# EAGLE design P1AM_Serial_Adapter_Board (EAGLE 9.6.2)
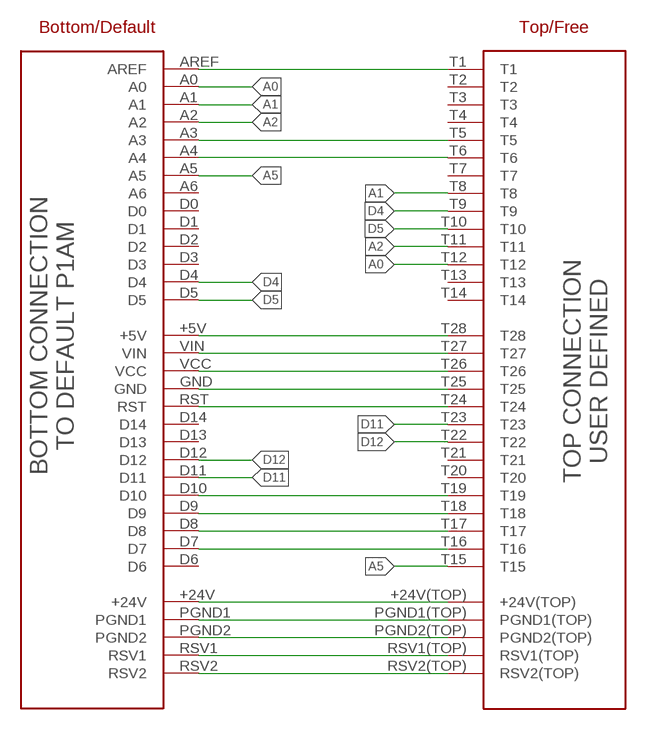
[diagram p0: schematic, sheet 1]

## Parts
J1  P1AM-PROTO-BLANK-SMD_HEADERS  [P1AM-PROTO-BLANK-SMD_HEADERS]

## Nets
5V: J1.+5V J1.T28
24V: J1.+24V J1.+24V(TOP)
A0: J1.A0 J1.T12
A1: J1.A1 J1.T8
A2: J1.A2 J1.T11
A3: J1.A3 J1.T5
A4: J1.A4 J1.T6
A5: J1.A5 J1.T15
AREF: J1.AREF J1.T1
D4: J1.D4 J1.T9
D5: J1.D5 J1.T10
D7: J1.D7 J1.T16
D8: J1.D8 J1.T17
D9: J1.D9 J1.T18
D10: J1.D10 J1.T19
D11: J1.D11 J1.T23
D12: J1.D12 J1.T22
GND: J1.GND J1.T25
PGND1: J1.PGND1 J1.PGND1(TOP)
PGND2: J1.PGND2 J1.PGND2(TOP)
RST: J1.RST J1.T24
RSV1: J1.RSV1 J1.RSV1(TOP)
RSV2: J1.RSV2 J1.RSV2(TOP)
VCC: J1.T26 J1.VCC
VIN: J1.T27 J1.VIN
Unconnected: J1.A6 J1.D0 J1.D1 J1.D2 J1.D3 J1.D6 J1.D13 J1.D14 J1.T2 J1.T3 J1.T4 J1.T7 J1.T13 J1.T14 J1.T20 J1.T21

## Library data of the parts
J1 = P1AM:P1AM-PROTO-BLANK-SMD_HEADERS

## Board
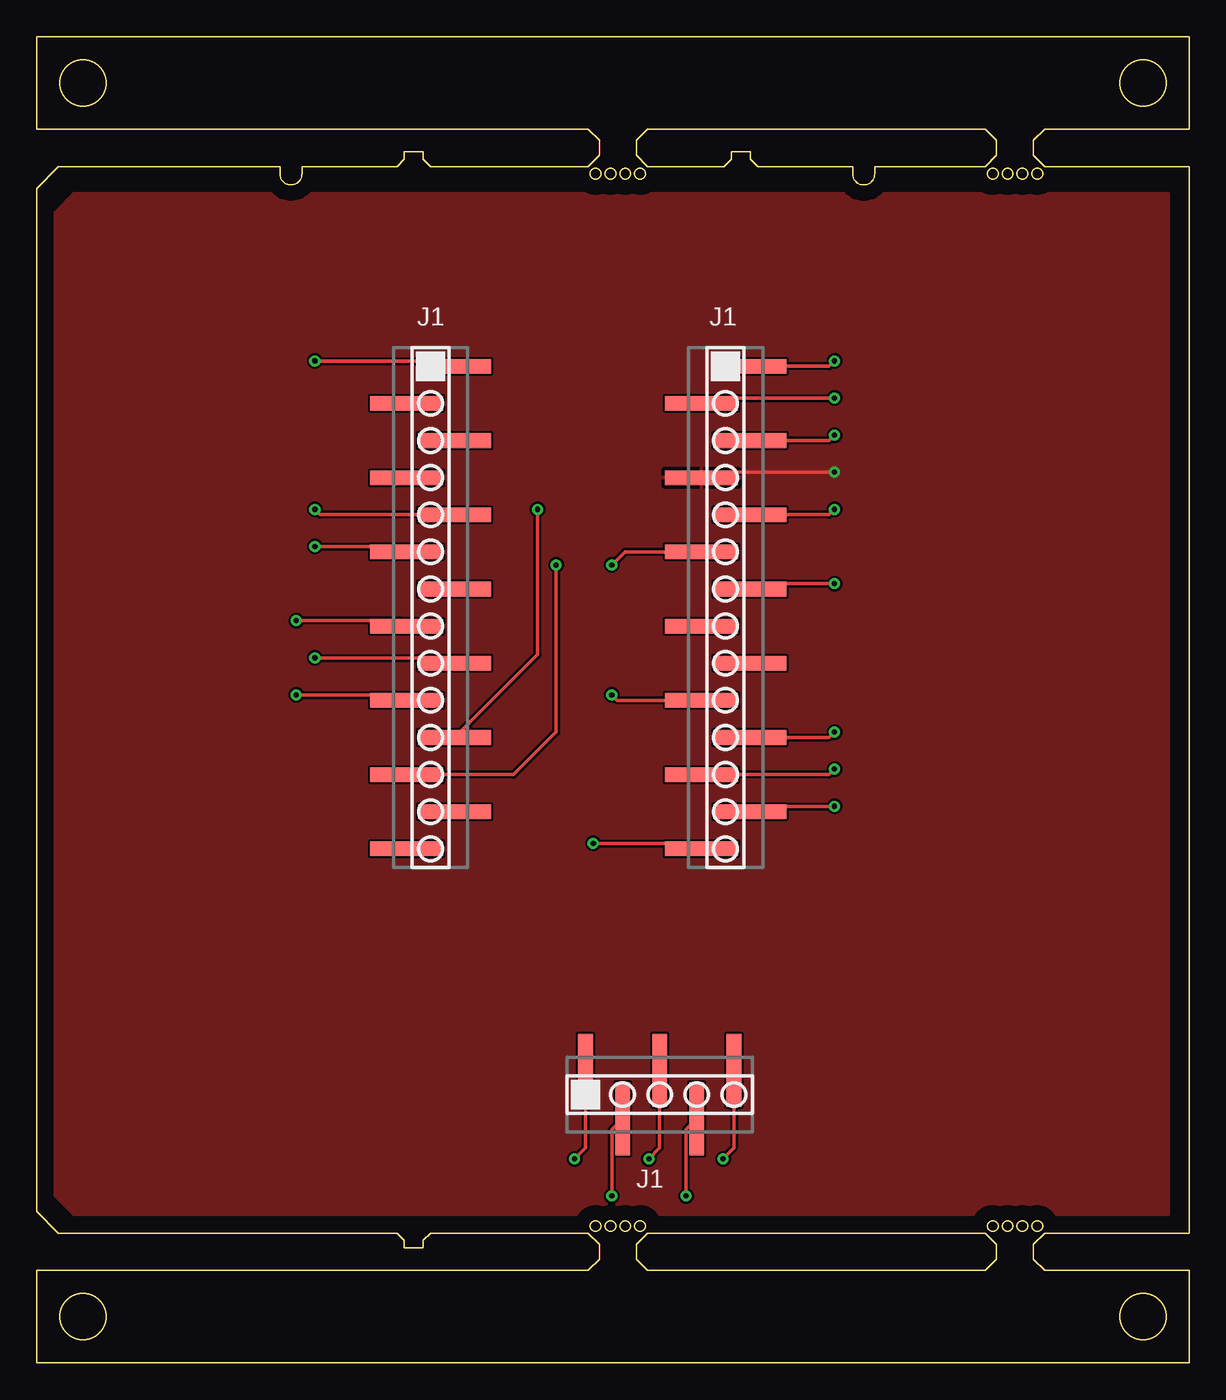
[diagram p1: board, top side]
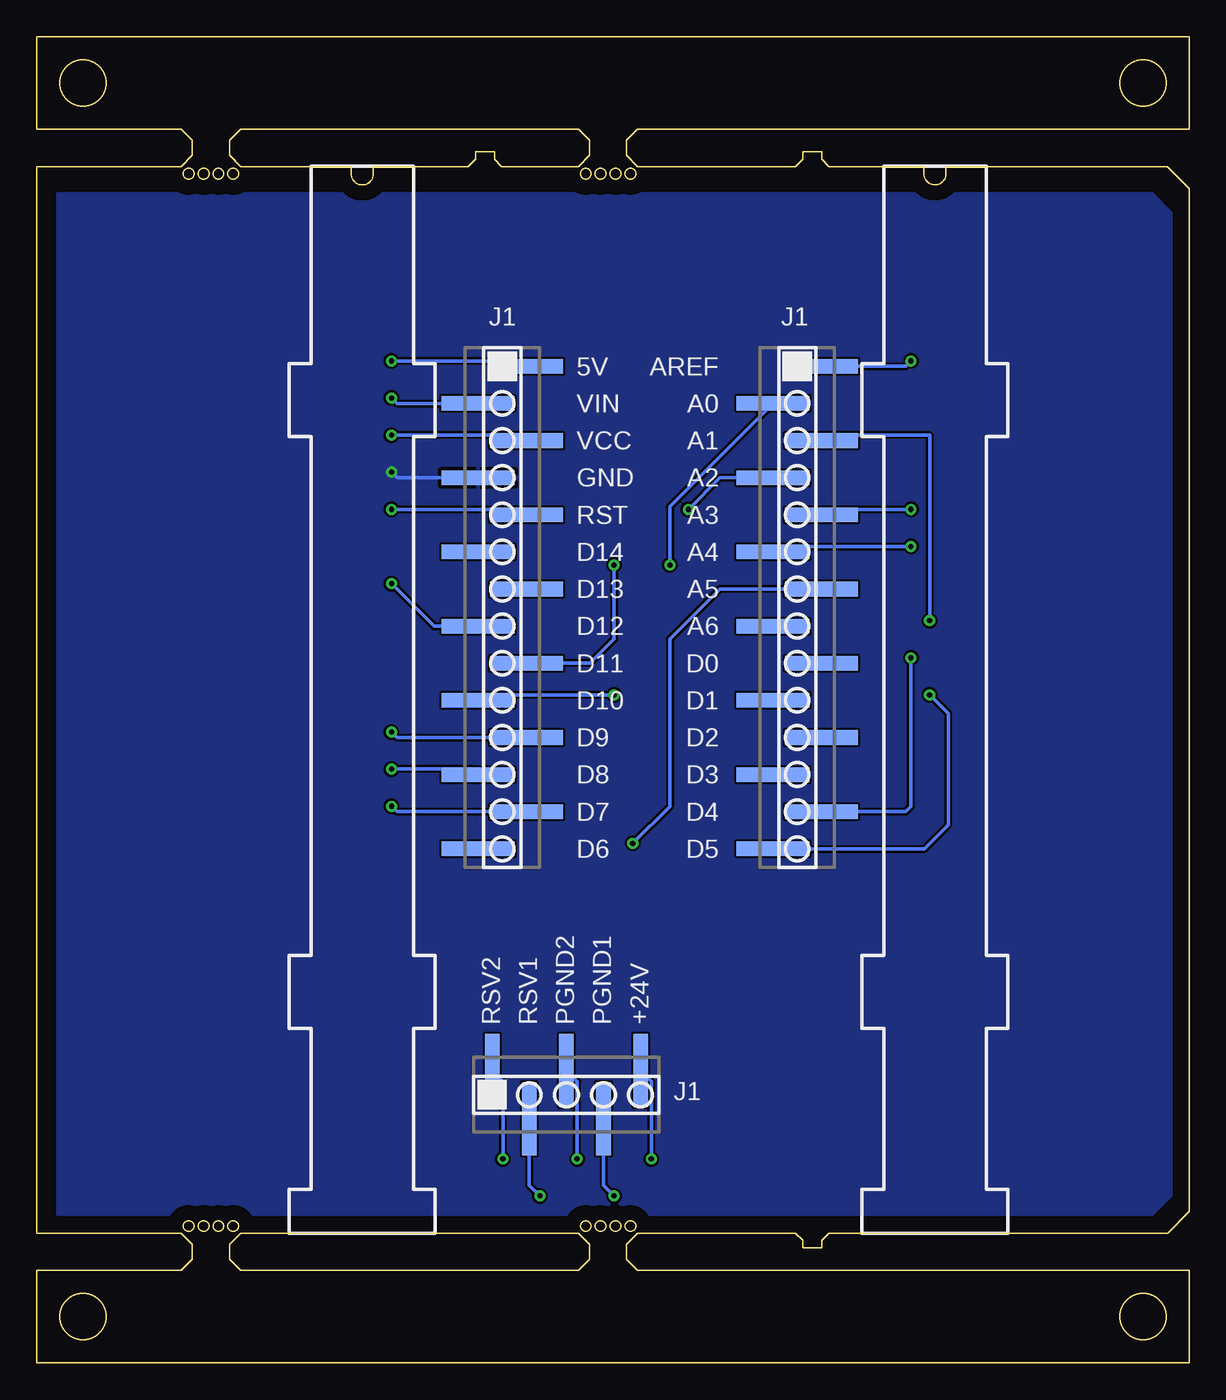
[diagram p2: board, bottom side, seen from below]

Size 78.91 x 90.78 mm. Coordinates in mm from the lower left corner, seen from the top.
Copper layers (1*16): Top 0.035mm / dielectric 1.5mm / Bottom 0.035mm
Design rules "default": minimum track width 6mil, minimum drill 0.35mm, track to track 6mil, track to pad 6mil, pad to pad 6mil, via to via 6mil, smd to smd 6mil, copper to edge 40mil, drill to drill 6mil, minimum pad ring 10mil, minimum via ring 8mil, stop-mask expansion 4mil, vias tented up to drill 0mil, thermal gap 10mil

### Footprints (pad centres in the part's own frame; a part is rotated, then mirrored left to right if it is on the bottom)
P1AM-PROTO-BLANK-SMD_HEADERS = smd 5 x 1 bottom: +5V 45.375,68.21; A0 28.495,65.67; A1 25.185,63.13; A2 28.495,60.59; A3 25.185,58.05; A4 28.495,55.51; A5 25.185,52.97; A6 28.495,50.43; AREF 25.185,68.21; D0 25.185,47.89; D1 28.495,45.35; D2 25.185,42.81; D3 28.495,40.27; D4 25.185,37.73; D5 28.495,35.19; D6 48.685,35.19; D7 45.375,37.73; D8 48.685,40.27; D9 45.375,42.81; D10 48.685,45.35; D11 45.375,47.89; D12 48.685,50.43; D13 45.375,52.97; D14 48.685,55.51; GND 48.685,60.59; RST 45.375,58.05; VCC 45.375,63.13; VIN 48.685,65.67 | smd 1 x 5 bottom: +24V 37.56,20.015; PGND1 40.1,16.705; PGND2 42.64,20.015; RSV1 45.18,16.705; RSV2 47.72,20.015 | smd 1 x 5: +24V(TOP) 37.57,20.025; PGND1(TOP) 40.11,16.715; PGND2(TOP) 42.65,20.025; RSV1(TOP) 45.19,16.715; RSV2(TOP) 47.73,20.025 | smd 5 x 1: T1 28.625,68.21; T2 25.315,65.67; T3 28.625,63.13; T4 25.315,60.59; T5 28.625,58.05; T6 25.315,55.51; T7 28.625,52.97; T8 25.315,50.43; T9 28.625,47.89; T10 25.315,45.35; T11 28.625,42.81; T12 25.315,40.27; T13 28.625,37.73; T14 25.315,35.19; T15 45.505,35.19; T16 48.815,37.73; T17 45.505,40.27; T18 48.815,42.81; T19 45.505,45.35; T20 48.815,47.89; T21 45.505,50.43; T22 48.815,52.97; T23 45.505,55.51; T24 48.815,58.05; T25 45.505,60.59; T26 48.815,63.13; T27 45.505,65.67; T28 48.815,68.21

### Placement (x,y rotation side)
J1  0,0 0 top

### Tracks (layer width: path | path; a pad name or v marks a point on that pad's centre or on a via)
5V  (via drill 0.35)
  Top 0.254: v54.61,68.58 54.24,68.21 J1.T28
  Bottom 0.254: J1.+5V 45.74,68.58 v54.61,68.58
24V  (via drill 0.35)
  Top 0.254: J1.+24V(TOP) 37.57,14.71 v36.83,13.97
  Bottom 0.254: v36.83,13.97 36.83,19.29 J1.+24V
A0  (via drill 0.35)
  Top 0.254: v35.56,54.61 35.56,43.18 32.65,40.27 J1.T12
  Bottom 0.254: J1.A0 35.56,58.6 v35.56,54.61
A1  (via drill 0.35)
  Top 0.254: J1.T8 24.95,50.8 v17.78,50.8
  Bottom 0.254: v17.78,50.8 17.78,63.5 24.82,63.5 J1.A1
A2  (via drill 0.35)
  Top 0.254: J1.T11 34.29,48.48 v34.29,58.42
  Bottom 0.254: v34.29,58.42 32.12,60.59 J1.A2
A3  (via drill 0.35)
  Top 0.254: J1.T5 19.42,58.05 v19.05,58.42
  Bottom 0.254: v19.05,58.42 24.82,58.42 J1.A3
A4  (via drill 0.35)
  Top 0.254: v19.05,55.88 24.95,55.88 J1.T6
  Bottom 0.254: J1.A4 28.12,55.88 v19.05,55.88
A5  (via drill 0.35)
  Top 0.254: v38.1,35.56 45.13,35.56 J1.T15
  Bottom 0.254: J1.A5 32.12,52.97 35.56,49.53 35.56,38.1 v38.1,35.56
AREF  (via drill 0.35)
  Top 0.254: v19.05,68.58 28.25,68.58 J1.T1
  Bottom 0.254: J1.AREF 19.42,68.21 v19.05,68.58
D4  (via drill 0.35)
  Top 0.254: v19.05,48.26 28.25,48.26 J1.T9
  Bottom 0.254: J1.D4 19.42,37.73 19.05,38.1 v19.05,48.26
D5  (via drill 0.35)
  Top 0.254: v17.78,45.72 24.95,45.72 J1.T10
  Bottom 0.254: J1.D5 18.15,35.19 16.51,36.83 16.51,44.45 v17.78,45.72
D7  (via drill 0.35)
  Top 0.254: J1.T16 49.19,38.1 v54.61,38.1
  Bottom 0.254: v54.61,38.1 54.24,37.73 J1.D7
D8  (via drill 0.35)
  Top 0.254: v54.61,40.64 54.24,40.27 J1.T17
  Bottom 0.254: J1.D8 49.05,40.64 v54.61,40.64
D9  (via drill 0.35)
  Top 0.254: J1.T18 54.24,42.81 v54.61,43.18
  Bottom 0.254: v54.61,43.18 54.24,42.81 J1.D9
D10  (via drill 0.35)
  Top 0.254: J1.T19 39.74,45.35 v39.37,45.72
  Bottom 0.254: v39.37,45.72 48.31,45.72 J1.D10
D11  (via drill 0.35)
  Top 0.254: J1.T23 40.27,55.51 v39.37,54.61
  Bottom 0.254: v39.37,54.61 39.37,49.53 41.01,47.89 J1.D11
D12  (via drill 0.35)
  Top 0.254: J1.T22 49.19,53.34 v54.61,53.34
  Bottom 0.254: v54.61,53.34 51.7,50.43 J1.D12
GND  (via drill 0.35)
  Top 0.254: J1.T25 45.88,60.96 v54.61,60.96
  Bottom 0.254: v54.61,60.96 54.24,60.59 J1.GND
  pour Top: 2.54,10.16 1.27,11.43 1.27,78.74 2.54,80.01 77.47,80.01 77.47,10.16
  pour Bottom: 2.54,80.01 1.27,78.74 1.27,11.43 2.54,10.16 77.47,10.16 77.47,80.01
PGND1  (via drill 0.35)
  Top 0.254: v39.37,11.43 39.37,15.97 J1.PGND1(TOP)
  Bottom 0.254: J1.PGND1 40.1,12.16 v39.37,11.43
PGND2  (via drill 0.35)
  Top 0.254: J1.PGND2(TOP) 42.65,14.71 v41.91,13.97
  Bottom 0.254: v41.91,13.97 41.91,19.29 J1.PGND2
RST  (via drill 0.35)
  Top 0.254: v54.61,58.42 54.24,58.05 J1.T24
  Bottom 0.254: J1.RST 45.74,58.42 v54.61,58.42
RSV1  (via drill 0.35)
  Top 0.254: v44.45,11.43 44.45,15.97 J1.RSV1(TOP)
  Bottom 0.254: J1.RSV1 45.18,12.16 v44.45,11.43
RSV2  (via drill 0.35)
  Top 0.254: J1.RSV2(TOP) 47.73,14.71 v46.99,13.97
  Bottom 0.254: v46.99,13.97 46.99,19.29 J1.RSV2
VCC  (via drill 0.35)
  Top 0.254: v54.61,63.5 54.24,63.13 J1.T26
  Bottom 0.254: J1.VCC 45.74,63.5 v54.61,63.5
VIN  (via drill 0.35)
  Top 0.254: J1.T27 45.88,66.04 v54.61,66.04
  Bottom 0.254: v54.61,66.04 54.24,65.67 J1.VIN